# Altium schematic sheet Main.SchDoc
size 420 x 297 mm; Address1: Address1; Address2: Address2; Address3: Address3; Address4: Address4; SheetNumber: 1; SheetTotal: 2
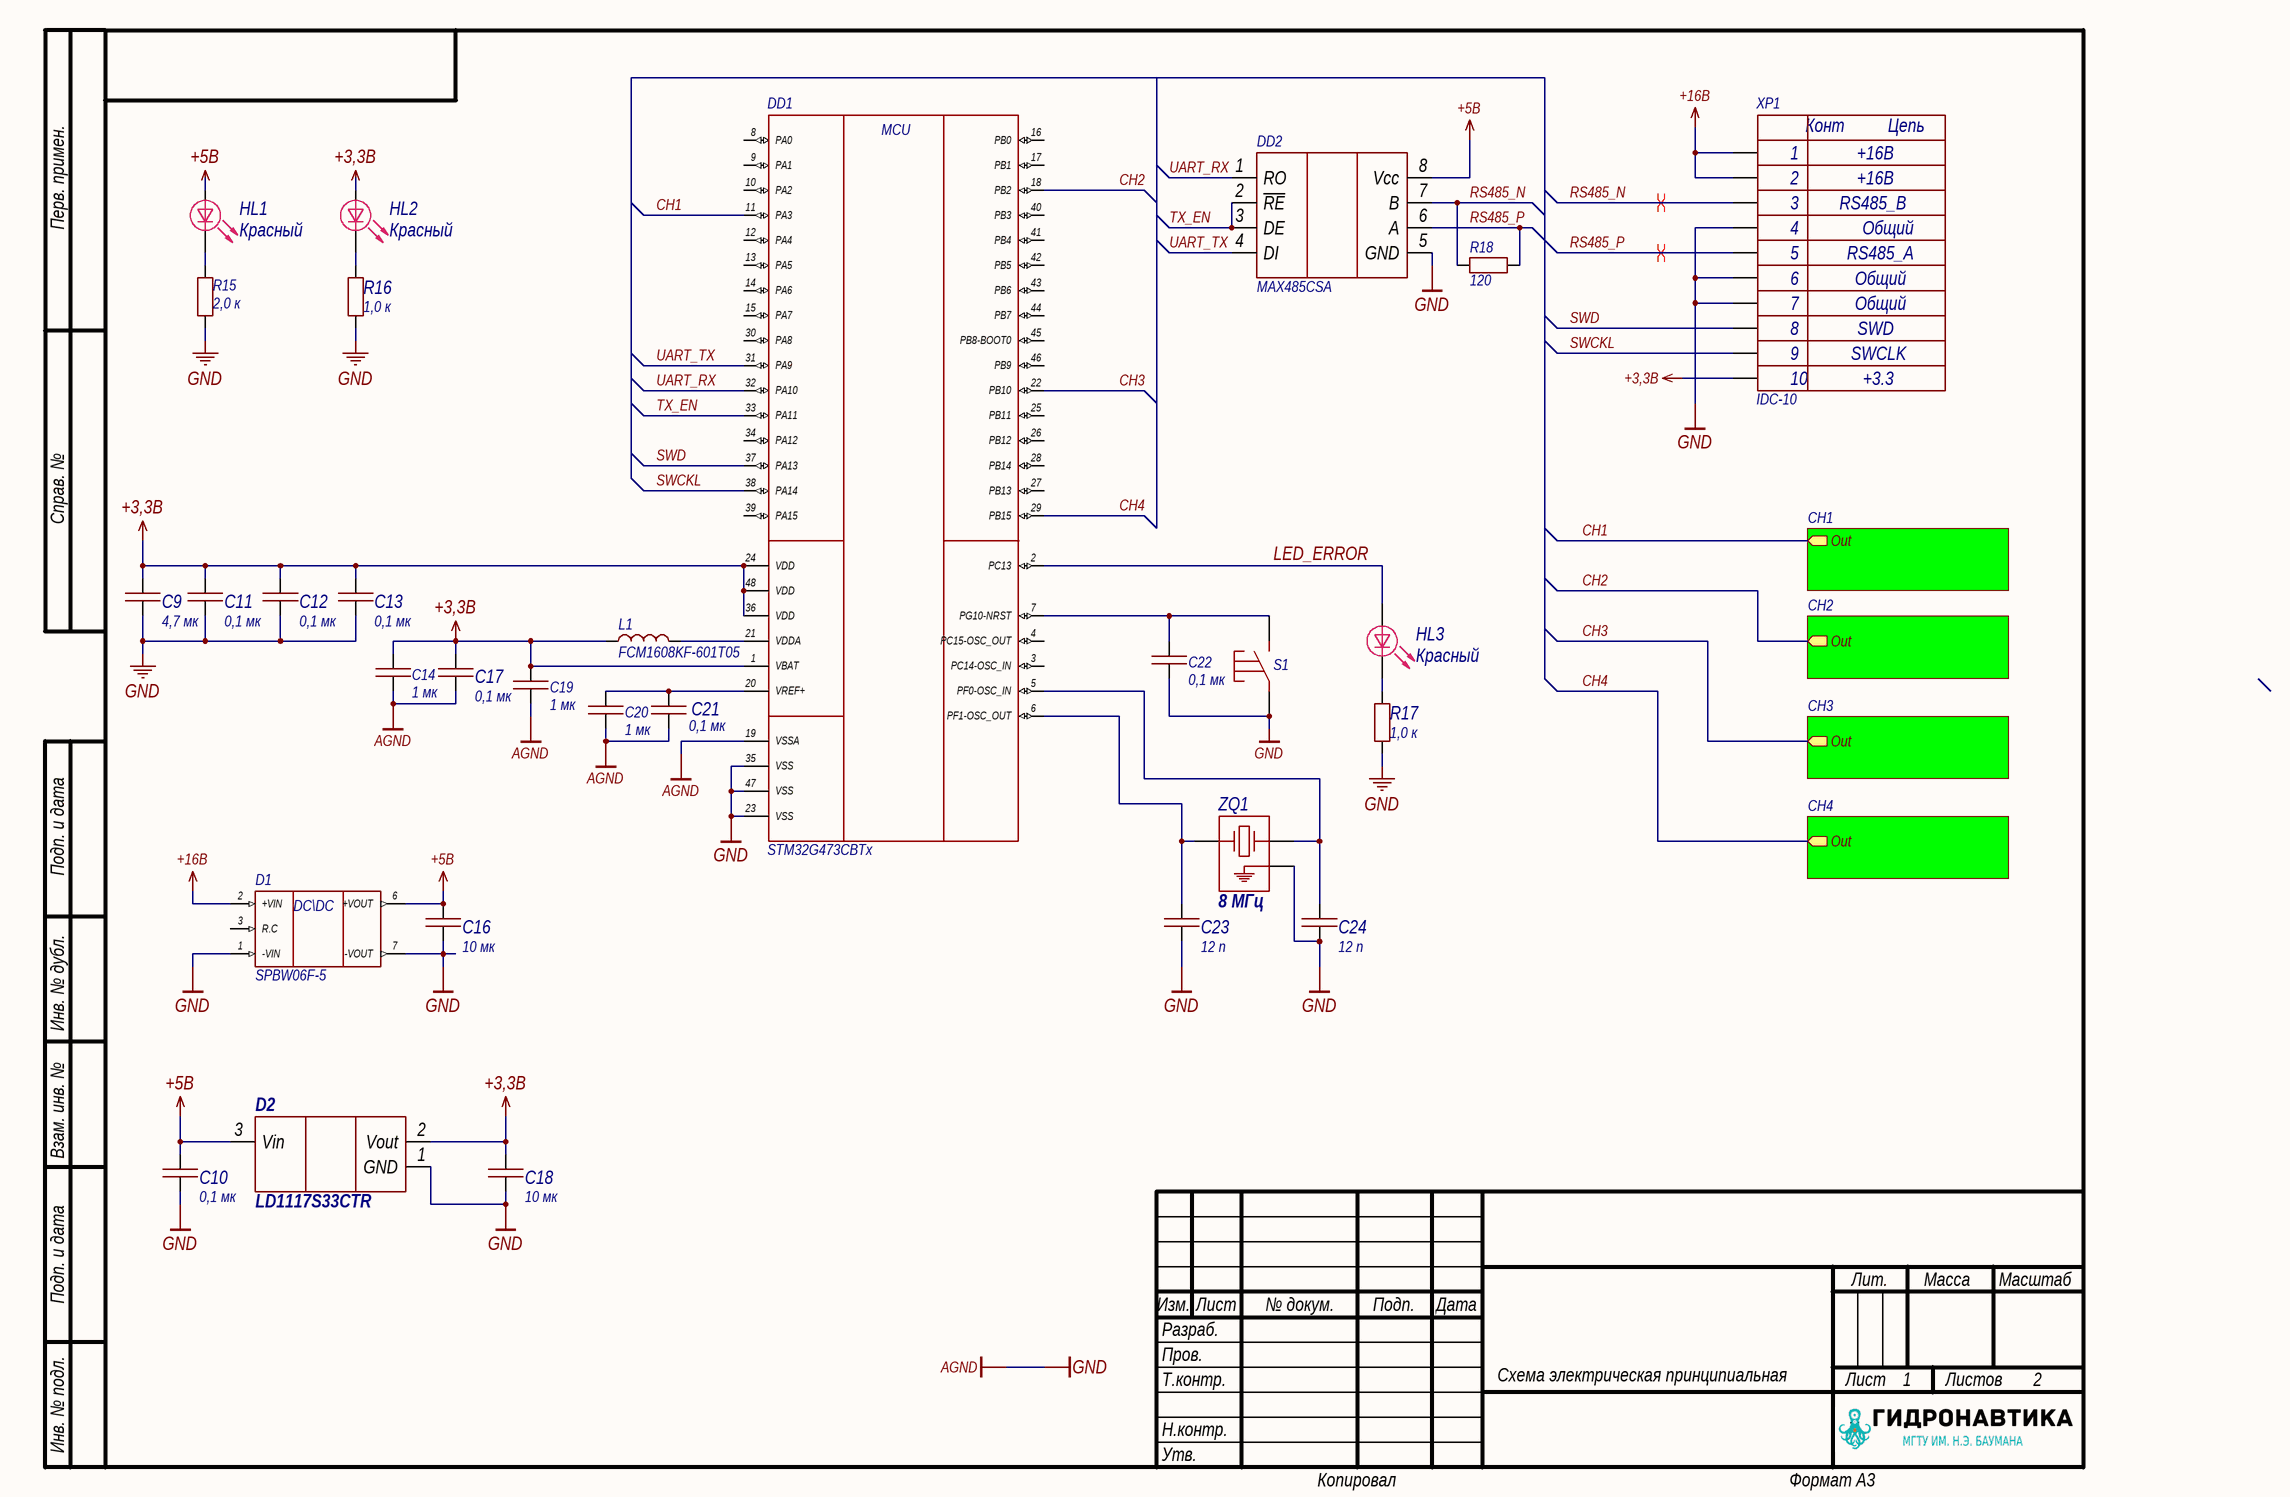
[diagram p0: Main.SchDoc]

## Parts
C9  value 4,7 мк  [1206C]  (hidden comment: Capacitor)
C10  value 0,1 мк  [0603C]  (hidden comment: Capacitor)
C11  value 0,1 мк  [0603C]  (hidden comment: Capacitor)
C12  value 0,1 мк  [0603C]  (hidden comment: Capacitor)
C13  value 0,1 мк  [0603C]  (hidden comment: Capacitor)
C14  value 1 мк  [0603C]  (hidden comment: Capacitor)
C16  value 10 мк  [1210C]  (hidden comment: Capacitor)
C17  value 0,1 мк  [0603C]  (hidden comment: Capacitor)
C18  value 10 мк  [1210C]  (hidden comment: Capacitor)
C19  value 1 мк  [0603C]  (hidden comment: Capacitor)
C20  value 1 мк  [0603C]  (hidden comment: Capacitor)
C21  value 0,1 мк  [0603C]  (hidden comment: Capacitor)
C22  value 0,1 мк  [0603C]  (hidden comment: Capacitor)
C23  value 12 п  [0603C]  (hidden comment: Capacitor)
C24  value 12 п  [0603C]  (hidden comment: Capacitor)
D1  SPBW06F-5  [CONV_SPBW06F-12]
D2  LD1117S33CTR  [SOT223]
DD1  STM32G473CBTx  [LQFP48-7x7mm]
DD2  MAX485CSA  [SOIC-8]
HL1  Color: Красный  [0805D]  (hidden comment: LED)
HL2  Color: Красный  [0805D]  (hidden comment: LED)
HL3  Color: Красный  [0805D]  (hidden comment: LED)
L1  FCM1608KF-601T05  [0603L]
R15  value 2,0 к  [0603R]  (hidden comment: Resistor)
R16  value 1,0 к  [0603R]  (hidden comment: Resistor)
R17  value 1,0 к  [0603R]  (hidden comment: Resistor)
R18  value 120  [0603R]  (hidden comment: Resistor)
S1  TSS-TD-19XA-XTR  [TSS-TD-19XA-XTR]  (value not drawn)
XP1  IDC-10  Value1: +16В  Value3: Общий  Value5: RS485_A  Value6: RS485_B  Value8: SWD  Value9: SWCLK  Value10: +3.3  [IDC-10]
ZQ1  value 8 МГц  [QSMD3.2x2.5]  (hidden comment: XTAL_GND)

## Sub-sheets
CH1 = Chanel.SchDoc: Out (out)
CH2 = Chanel.SchDoc: Out (out)
CH3 = Chanel.SchDoc: Out (out)
CH4 = Chanel.SchDoc: Out (out)

## Nets
+3,3В: C9.2 C11.2 C12.2 C13.2 C14.2 C17.2 C18.2 C19.2 D2.2(Vout) DD1.1(VBAT) DD1.24(VDD) DD1.36(VDD) DD1.48(VDD) HL2.1 L1.1 XP1.10
+5В: C10.2 C16.2 D1.6(+VOUT) D2.3(Vin) DD2.8(Vcc) HL1.1
+16В: D1.2(+VIN) XP1.1 XP1.2
AGND: C9.1 C10.1 C11.1 C12.1 C13.1 C14.1 C16.1 C17.1 C18.1 C19.1 C20.1 C21.1 C22.1 C23.1 C24.1 D1.1(-VIN) D1.7(-VOUT) D2.1(GND) DD1.19(VSSA) DD1.23(VSS) DD1.35(VSS) DD1.47(VSS) DD2.5(GND) R15.1 R16.1 R17.1 S1.1 XP1.4 XP1.6 XP1.7 ZQ1.3  [also labelled GND]
CH1: DD1.11(PA3) ; sheet CH1/Out
CH2: DD1.18(PB2) ; sheet CH2/Out
CH3: DD1.22(PB10) ; sheet CH3/Out
CH4: DD1.29(PB15) ; sheet CH4/Out
LED_ERROR: DD1.2(PC13) HL3.1
RS485_N: DD2.7(B) R18.2 XP1.3
RS485_P: DD2.6(A) R18.1 XP1.5
SWCKL: DD1.38(PA14) XP1.9
SWD: DD1.37(PA13) XP1.8
TX_EN: DD1.33(PA11) DD2.2(~{RE}) DD2.3(DE)
UART_RX: DD1.32(PA10) DD2.1(RO)
UART_TX: DD1.31(PA9) DD2.4(DI)
NetC20_2: C20.2 C21.2 DD1.20(VREF+)
NetC22_2: C22.2 DD1.7(PG10-NRST) S1.2
NetC23_2: C23.2 DD1.6(PF1-OSC_OUT) ZQ1.1
NetC24_2: C24.2 DD1.5(PF0-OSC_IN) ZQ1.2
NetDD1_21: DD1.21(VDDA) L1.2
NetHL1_2: HL1.2 R15.2
NetHL2_2: HL2.2 R16.2
NetHL3_2: HL3.2 R17.2

Not connected (* = marked no-connect by the designer): D1 3(R.C); DD1 3(PC14-OSC_IN) 4(PC15-OSC_OUT) 8(PA0) 9(PA1) 10(PA2) 12(PA4) 13(PA5) 14(PA6) 15(PA7) 16(PB0) 17(PB1) 25(PB11) 26(PB12) 27(PB13) 28(PB14) 30(PA8) 34(PA12) 39(PA15) 40(PB3) 41(PB4) 42(PB5) 43(PB6) 44(PB7) 45(PB8-BOOT0) 46(PB9)

## Layout directives
differential pair: RS485_N, RS485_P

## Notes on the sheet
- Перв. примен.
- Справ. №
- Подп. и дата
- Инв. № дубл.
- Взам. инв. №
- Разраб.
- Изм.
- Лист
- № докум.
- Подп.
- Дата
- Лит.
- Масса
- Масштаб
- Пров.
- Т.контр.
- Схема электрическая принципиальная
- Листов
- Инв. № подл.
- Утв.
- Н.контр.
- Копировал
- Формат А3
- (in symbol IDC-10) Конт; Цепь
- (in symbol SPBW06F-12) DC\DC
- (in symbol STM32G473CBTx) MCU

## Library data of the parts
C9 = Capacitor_4,7u_10_50V_X7R_1206C: Конденсатор; Library Path2: Schematic\Capacitor.SchLib; Tolerance: 0,1; Voltage (V): 50; Dielectric: X7R; Capacity (nF): 4700; Part Number: Capacitor_4,7u_10_50V_X7R_1206C
C10-C13 C17 C21 = Capacitor_0,1u_10_50V_X7R_0603C: Конденсатор; Library Path2: Schematic\Capacitor.SchLib; Tolerance: 0,1; Voltage (V): 50; Dielectric: X7R; Capacity (nF): 100; Part Number: Capacitor_0,1u_10_50V_X7R_0603C
C14 C19 C20 = Capacitor_1u_10_50V_X7R_0603C: Конденсатор 0603C ёмкостью 1 мк 10%, 50 В, X7R; Voltage (V): 50; Capacity (nF): 1000; Part Number: Capacitor_1u_10_50V_X7R_0603C; Tolerance: 10%; Dielectric: X7R
C16 C18 = Capacitor_10u_10_35V_X7R_1210C: Конденсатор; Library Path2: Schematic\Capacitor.SchLib; Tolerance: 0,1; Voltage (V): 35; Dielectric: X7R; Capacity (nF): 10000; Part Number: Capacitor_10u_10_35V_X7R_1210C
C22 = Capacitor_0,1u_10_50V_X7R_0603C: Конденсатор 0603C ёмкостью 0,1 мк 10%, 50 В, X7R; Voltage (V): 50; Capacity (nF): 100; Part Number: Capacitor_0,1u_10_50V_X7R_0603C; Tolerance: 10%; Dielectric: X7R
C23 C24 = 0,1 мк: Конденсатор 12п; Part Number: Capacitor
D1 = SPBW06F-12: Isolated Module DC DC Converter 1 Output 12V - - - 500mA 9V - 36V Input; MF: MEAN WELL; SnapEDA_Link: https://www.snapeda.com/parts/SPBW06F-12/Mean+Well/view-part/?ref=snap; Package: SIP-8 Mean Well; Value: *; MP: SPBW06F-12; Check_prices: https://www.snapeda.com/parts/SPBW06F-12/Mean+Well/view-part/?ref=eda
D2 = LD1117S33CTR: Линейный стабилизатор напряжения; Part Number: LD1117S33CTR
DD1 = STM32G473CBTx: Mainstream Arm Cortex-M4 core with DSP and FPU, 170MHz with 128Kbytes of Flash memory, Math Accelerator, High Analog level integration; Manufacturer_Part_Number: stm32g4_lqfp48_t1; Built_By: EMA_Jessica; Vendor: STMicroelectronics; Copyright: Copyright (C) 2016 Accelerated Designs. All rights reserved; RefDes: RefDes; Type: DEV; Value: Value
DD2 = MAX485CSA: RS-485 приёмопередатчик; Part Number: MAX485CSA
HL1-HL3 = LED: Светодиод; Part Number: LED
L1 = Inductance: Катушка индуктивности; Part Number: Inductance
R15 = Resistor_2.0k_1_0603: Резистор номиналом 2,0 кОм 1%; Power: *; Part Number: Resistor_2.0k_1_0603; Tolerance: 1%
R16 R17 = Resistor_1.0k_1_0603: Резистор номиналом 1,0 кОм и точностью 1%; Power: *; Part Number: Resistor_1.0k_1_0603; Tolerance: 1%
R18 = Resistor_120_1_0603: Резистор номиналом 120 Ом 1%; Power: *; Part Number: Resistor_120_1_0603; Tolerance: 1%
S1 = TSS-TD-19XA-XTR: Тактовая кнопка; Автор: glebmih; Part Number: TSS-TD-19XA-XTR; Datasheet: https://cdn.promelec.ru/upload/items/2023/04/17/TSS-TD-19XA.pdf
XP1 = IDC-10: 10-пиновый разъём с ключём; System: Connector; Value2: +16В; Value4: Общий; Value7: Общий; Part Number: IDC-10
ZQ1 = XTAL_GND: Кварцевый резонатор с входом земли; Part Number: XTAL_GND